# EAGLE schematic OSSIOBC (EAGLE 6.1)

## Sheet 1 of 4
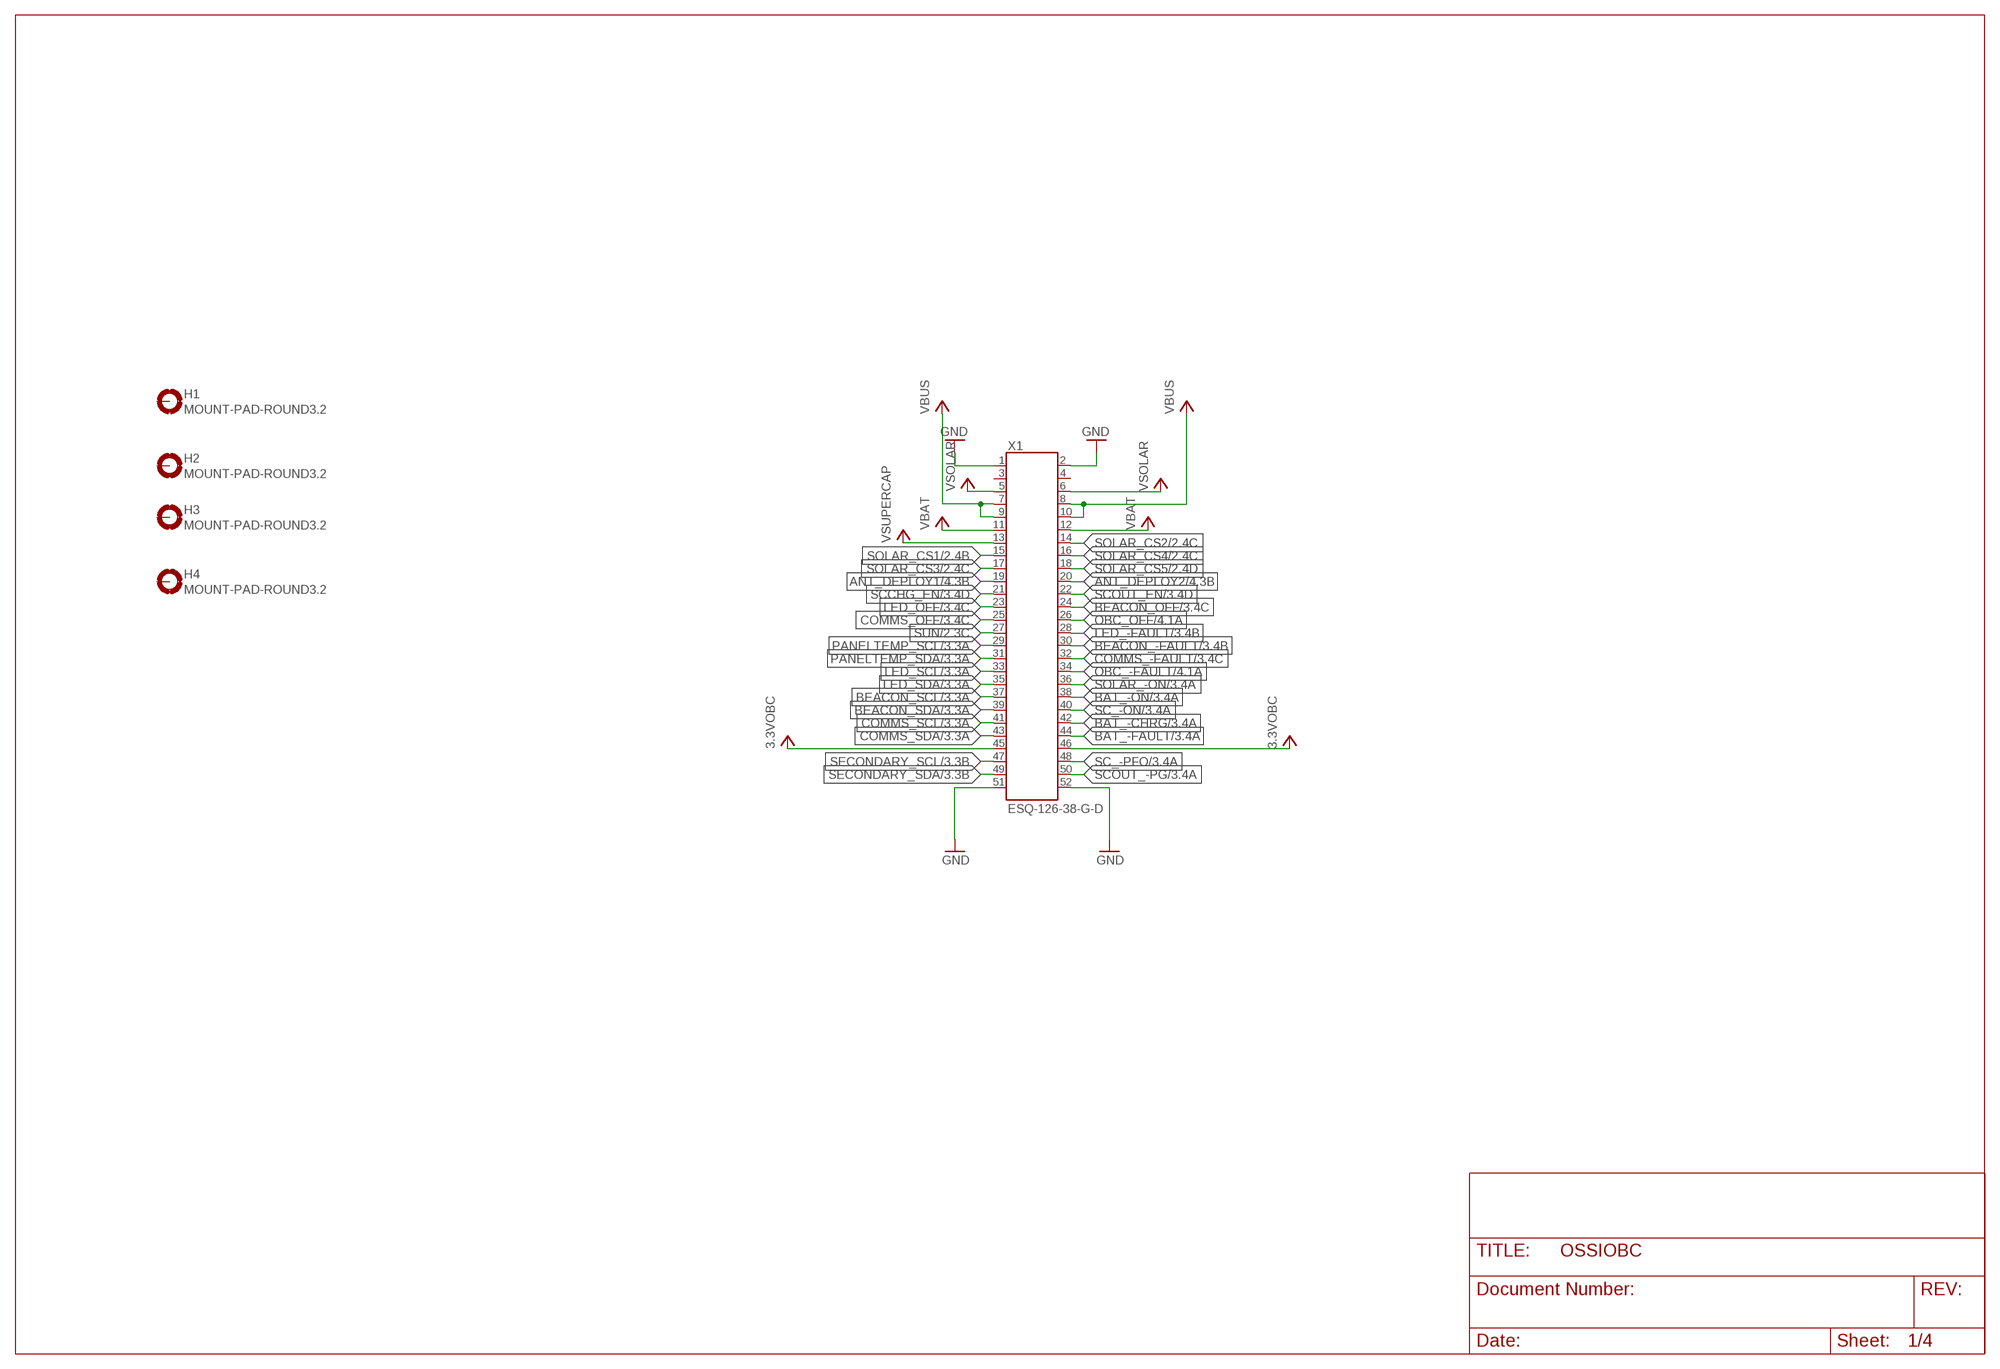
[diagram p0: schematic, sheet 1]

### Parts
H1  MOUNT-PAD-ROUND3.2  [3.2-PAD-ROUND]
H2  MOUNT-PAD-ROUND3.2  [3.2-PAD-ROUND]
H3  MOUNT-PAD-ROUND3.2  [3.2-PAD-ROUND]
H4  MOUNT-PAD-ROUND3.2  [3.2-PAD-ROUND]
X1  ESQ-126-38-G-D  [ESQ-126-XX-X-D]

### Nets
3.3VOBC: X1.45 X1.46 ; also sheet 2,3,4
ANT_DEPLOY1: X1.19 ; also sheet 4
ANT_DEPLOY2: X1.20 ; also sheet 4
BAT_-CHRG: X1.42 ; also sheet 3
BAT_-FAULT: X1.44 ; also sheet 3
BAT_-ON: X1.38 ; also sheet 3
BEACON_-FAULT: X1.30 ; also sheet 3
BEACON_OFF: X1.24 ; also sheet 3
BEACON_SCL: X1.37 ; also sheet 3
BEACON_SDA: X1.39 ; also sheet 3
COMMS_-FAULT: X1.32 ; also sheet 3
COMMS_OFF: X1.25 ; also sheet 3
COMMS_SCL: X1.41 ; also sheet 3
COMMS_SDA: X1.43 ; also sheet 3
GND: X1.1 X1.2 X1.51 X1.52 ; also sheet 2,3,4
LED_-FAULT: X1.28 ; also sheet 3
LED_OFF: X1.23 ; also sheet 3
LED_SCL: X1.33 ; also sheet 3
LED_SDA: X1.35 ; also sheet 3
OBC_-FAULT: X1.34 ; also sheet 4
OBC_OFF: X1.26 ; also sheet 4
PANELTEMP_SCL: X1.29 ; also sheet 3
PANELTEMP_SDA: X1.31 ; also sheet 3
SC_-ON: X1.40 ; also sheet 3
SC_-PFO: X1.48 ; also sheet 3
SCCHG_EN: X1.21 ; also sheet 3
SCOUT_-PG: X1.50 ; also sheet 3
SCOUT_EN: X1.22 ; also sheet 3
SECONDARY_SCL: X1.47 ; also sheet 3
SECONDARY_SDA: X1.49 ; also sheet 3
SOLAR_-ON: X1.36 ; also sheet 3
SOLAR_CS1: X1.15 ; also sheet 2
SOLAR_CS2: X1.14 ; also sheet 2
SOLAR_CS3: X1.17 ; also sheet 2
SOLAR_CS4: X1.16 ; also sheet 2
SOLAR_CS5: X1.18 ; also sheet 2
SUN: X1.27 ; also sheet 2
VBAT: X1.11 X1.12 ; also sheet 2
VBUS: X1.7 X1.8 X1.9 X1.10 ; also sheet 2,3,4
VSOLAR: X1.5 X1.6 ; also sheet 2,3
VSUPERCAP: X1.13 ; also sheet 2
Unconnected: H1.B3,2(MOUNT) H2.B3,2(MOUNT) H3.B3,2(MOUNT) H4.B3,2(MOUNT) X1.3 X1.4

## Sheet 2 of 4
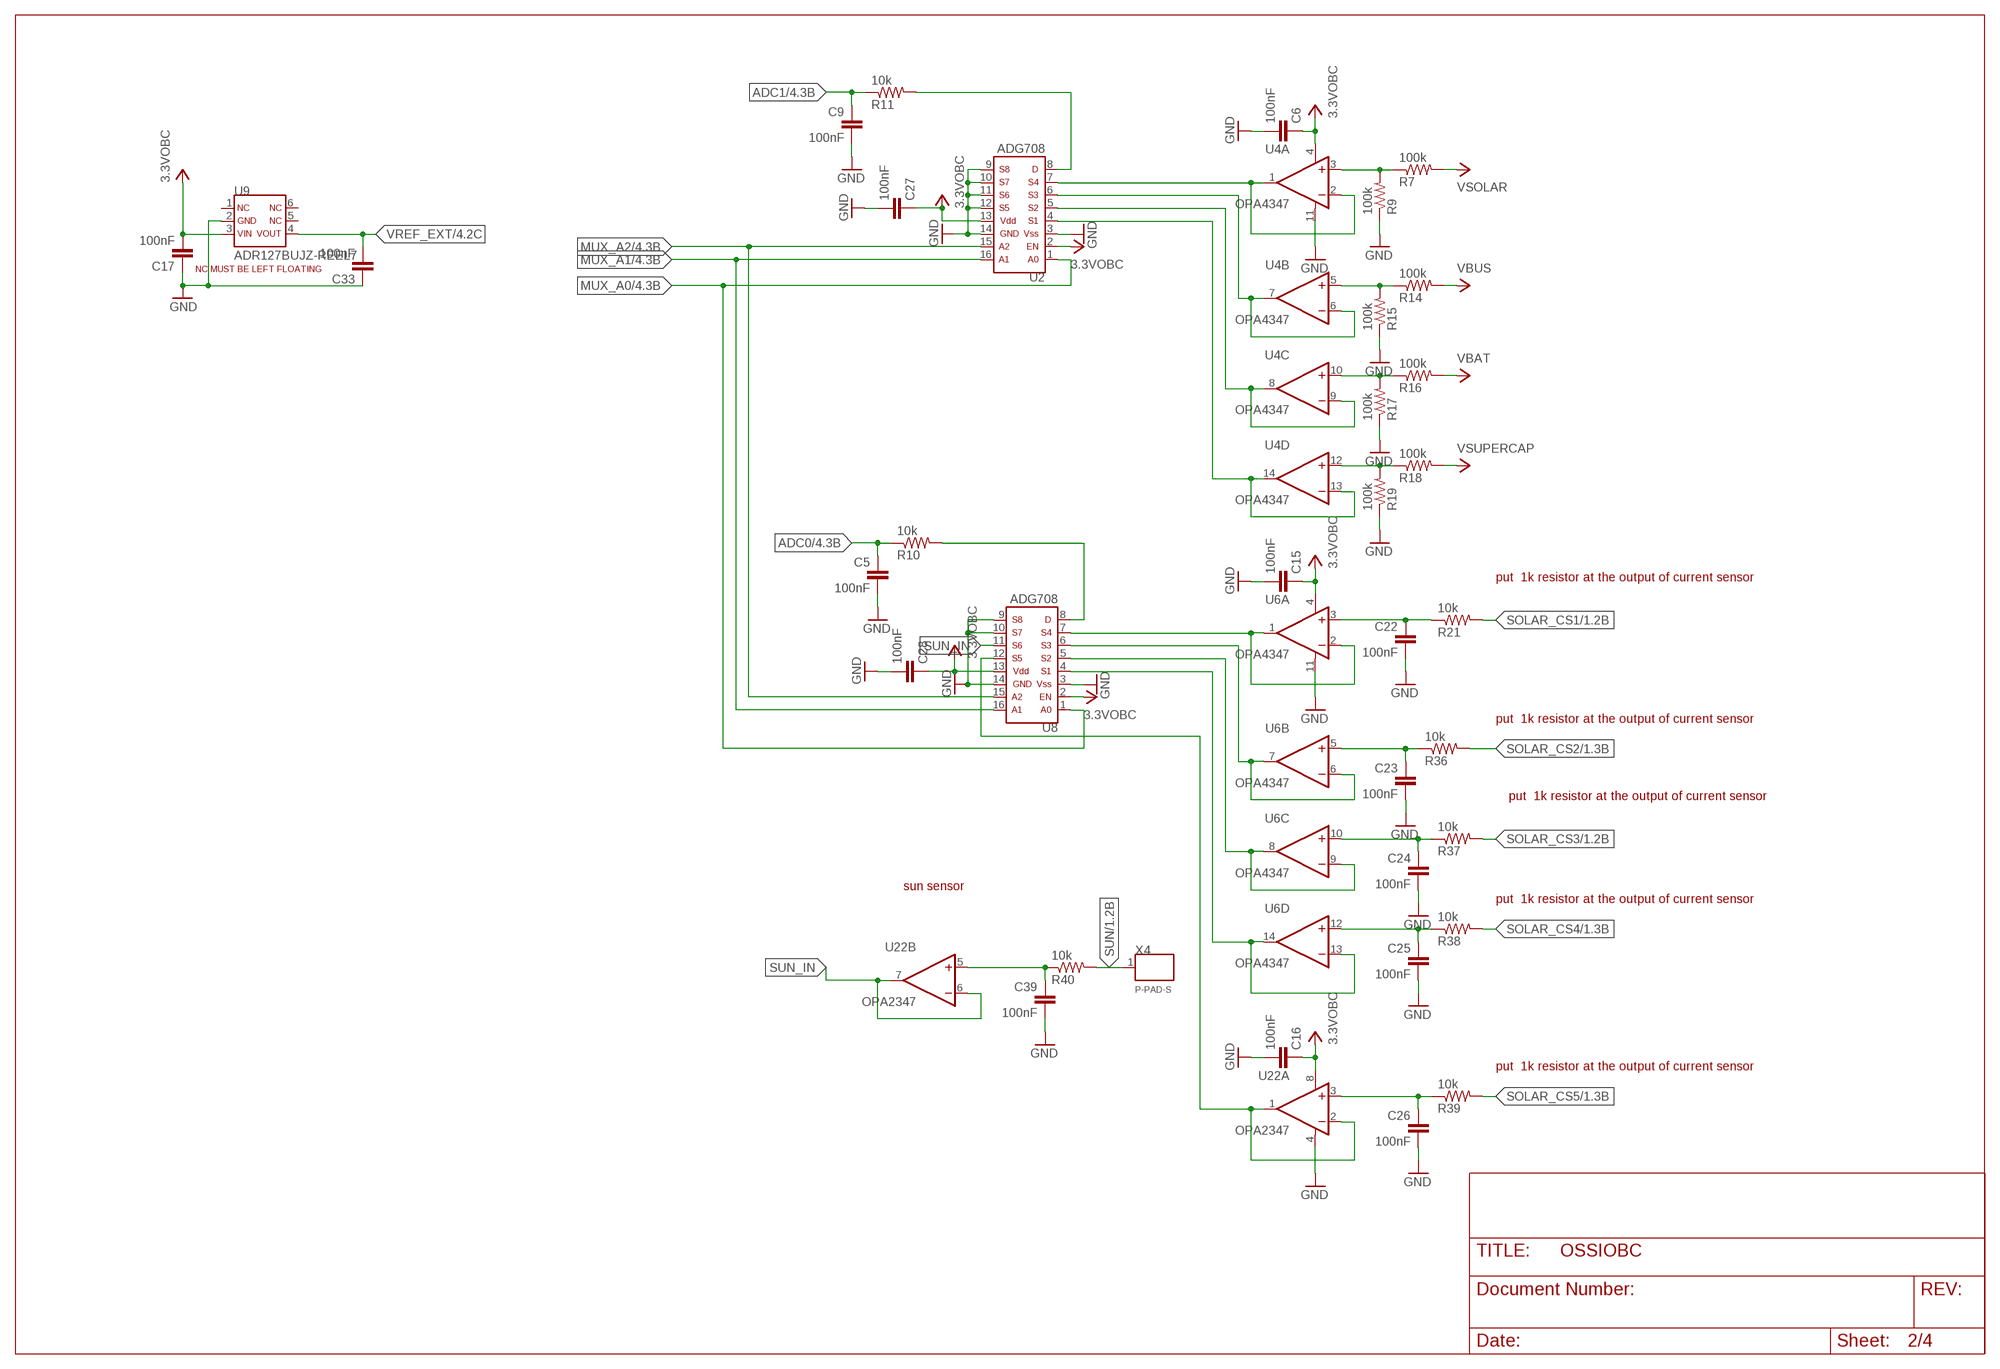
[diagram p1: schematic, sheet 2]

### Parts
C5  100nF  C0603(1608)  [C0603(1608)]
C6  100nF  C0603(1608)  [C0603(1608)]
C9  100nF  C0603(1608)  [C0603(1608)]
C15  100nF  C0603(1608)  [C0603(1608)]
C16  100nF  C0603(1608)  [C0603(1608)]
C17  100nF  C0603(1608)  [C0603(1608)]
C22  100nF  C0603(1608)  [C0603(1608)]
C23  100nF  C0603(1608)  [C0603(1608)]
C24  100nF  C0603(1608)  [C0603(1608)]
C25  100nF  C0603(1608)  [C0603(1608)]
C26  100nF  C0603(1608)  [C0603(1608)]
C27  100nF  C0603(1608)  [C0603(1608)]
C28  100nF  C0603(1608)  [C0603(1608)]
C33  100nF  C0603(1608)  [C0603(1608)]
C39  100nF  C0603(1608)  [C0603(1608)]
R7  100k  R0603(1608)  [R0603(1608)]
R9  100k  R0603(1608)  [R0603(1608)]
R10  10k  R0603(1608)  [R0603(1608)]
R11  10k  R0603(1608)  [R0603(1608)]
R14  100k  R0603(1608)  [R0603(1608)]
R15  100k  R0603(1608)  [R0603(1608)]
R16  100k  R0603(1608)  [R0603(1608)]
R17  100k  R0603(1608)  [R0603(1608)]
R18  100k  R0603(1608)  [R0603(1608)]
R19  100k  R0603(1608)  [R0603(1608)]
R21  10k  R0603(1608)  [R0603(1608)]
R36  10k  R0603(1608)  [R0603(1608)]
R37  10k  R0603(1608)  [R0603(1608)]
R38  10k  R0603(1608)  [R0603(1608)]
R39  10k  R0603(1608)  [R0603(1608)]
R40  10k  R0603(1608)  [R0603(1608)]
U2  ADG708  [TSSOP16-RU]
U4  OPA4347  [TSSOP14-PW]
U6  OPA4347  [TSSOP14-PW]
U8  ADG708  [TSSOP16-RU]
U9  ADR127BUJZ-REEL7  [TSOT-6UJ-6]
U22  OPA2347  [SOT23-8DCN]
X4  P-PAD-S  [P-PAD-S]

### Nets
3.3VOBC: C6.1 C15.1 C16.1 C17.2 C27.1 C28.1 U2.2 U2.13 U4.4(A:V+) U6.4(A:V+) U8.2 U8.13 U9.3 U22.8(A:V+) ; also sheet 1,3,4
ADC0: C5.1 R10.1 ; also sheet 4
ADC1: C9.1 R11.1 ; also sheet 4
GND: C5.2 C6.2 C9.2 C15.2 C16.2 C17.1 C22.2 C23.2 C24.2 C25.2 C26.2 C27.2 C28.2 C33.1 C39.2 R9.1 R15.1 R17.1 R19.1 U2.3 U2.9 U2.10 U2.11 U2.12 U2.14 U4.11(A:V-) U6.11(A:V-) U8.3 U8.9 U8.10 U8.14 U9.2 U22.4(A:V-) ; also sheet 1,3,4
MUX_A0: U2.1 U8.1 ; also sheet 4
MUX_A1: U2.16 U8.16 ; also sheet 4
MUX_A2: U2.15 U8.15 ; also sheet 4
N$2: R7.1 R9.2 U4.3(A:+IN)
N$3: U2.7 U4.1(A:OUT) U4.2(A:-IN)
N$8: U2.6 U4.6(B:-IN) U4.7(B:OUT)
N$9: U2.5 U4.8(C:OUT) U4.9(C:-IN)
N$11: U2.4 U4.13(D:-IN) U4.14(D:OUT)
N$12: U6.1(A:OUT) U6.2(A:-IN) U8.7
N$21: U6.6(B:-IN) U6.7(B:OUT) U8.6
N$24: R14.1 R15.2 U4.5(B:+IN)
N$25: R16.1 R17.2 U4.10(C:+IN)
N$26: R18.1 R19.2 U4.12(D:+IN)
N$27: R11.2 U2.8
N$28: U6.8(C:OUT) U6.9(C:-IN) U8.5
N$29: R10.2 U8.8
N$30: U6.13(D:-IN) U6.14(D:OUT) U8.4
N$31: U8.12 U22.1(A:OUT) U22.2(A:-IN)
N$51: C22.1 R21.1 U6.3(A:+IN)
N$52: C23.1 R36.1 U6.5(B:+IN)
N$53: C24.1 R37.1 U6.10(C:+IN)
N$54: C25.1 R38.1 U6.12(D:+IN)
N$55: C26.1 R39.1 U22.3(A:+IN)
N$58: C39.1 R40.1 U22.5(B:+IN)
SOLAR_CS1: R21.2 ; also sheet 1
SOLAR_CS2: R36.2 ; also sheet 1
SOLAR_CS3: R37.2 ; also sheet 1
SOLAR_CS4: R38.2 ; also sheet 1
SOLAR_CS5: R39.2 ; also sheet 1
SUN: R40.2 X4.1 ; also sheet 1
SUN_IN: U8.11 U22.6(B:-IN) U22.7(B:OUT)
VBAT: R16.2 ; also sheet 1
VBUS: R14.2 ; also sheet 1,3,4
VREF_EXT: C33.2 U9.4 ; also sheet 4
VSOLAR: R7.2 ; also sheet 1,3
VSUPERCAP: R18.2 ; also sheet 1
Unconnected: U9.1 U9.5 U9.6

### Notes on the sheet
- put  1k resistor at the output of current sensor
- put  1k resistor at the output of current sensor
- put  1k resistor at the output of current sensor
- sun sensor
- put  1k resistor at the output of current sensor
- put  1k resistor at the output of current sensor

## Sheet 3 of 4
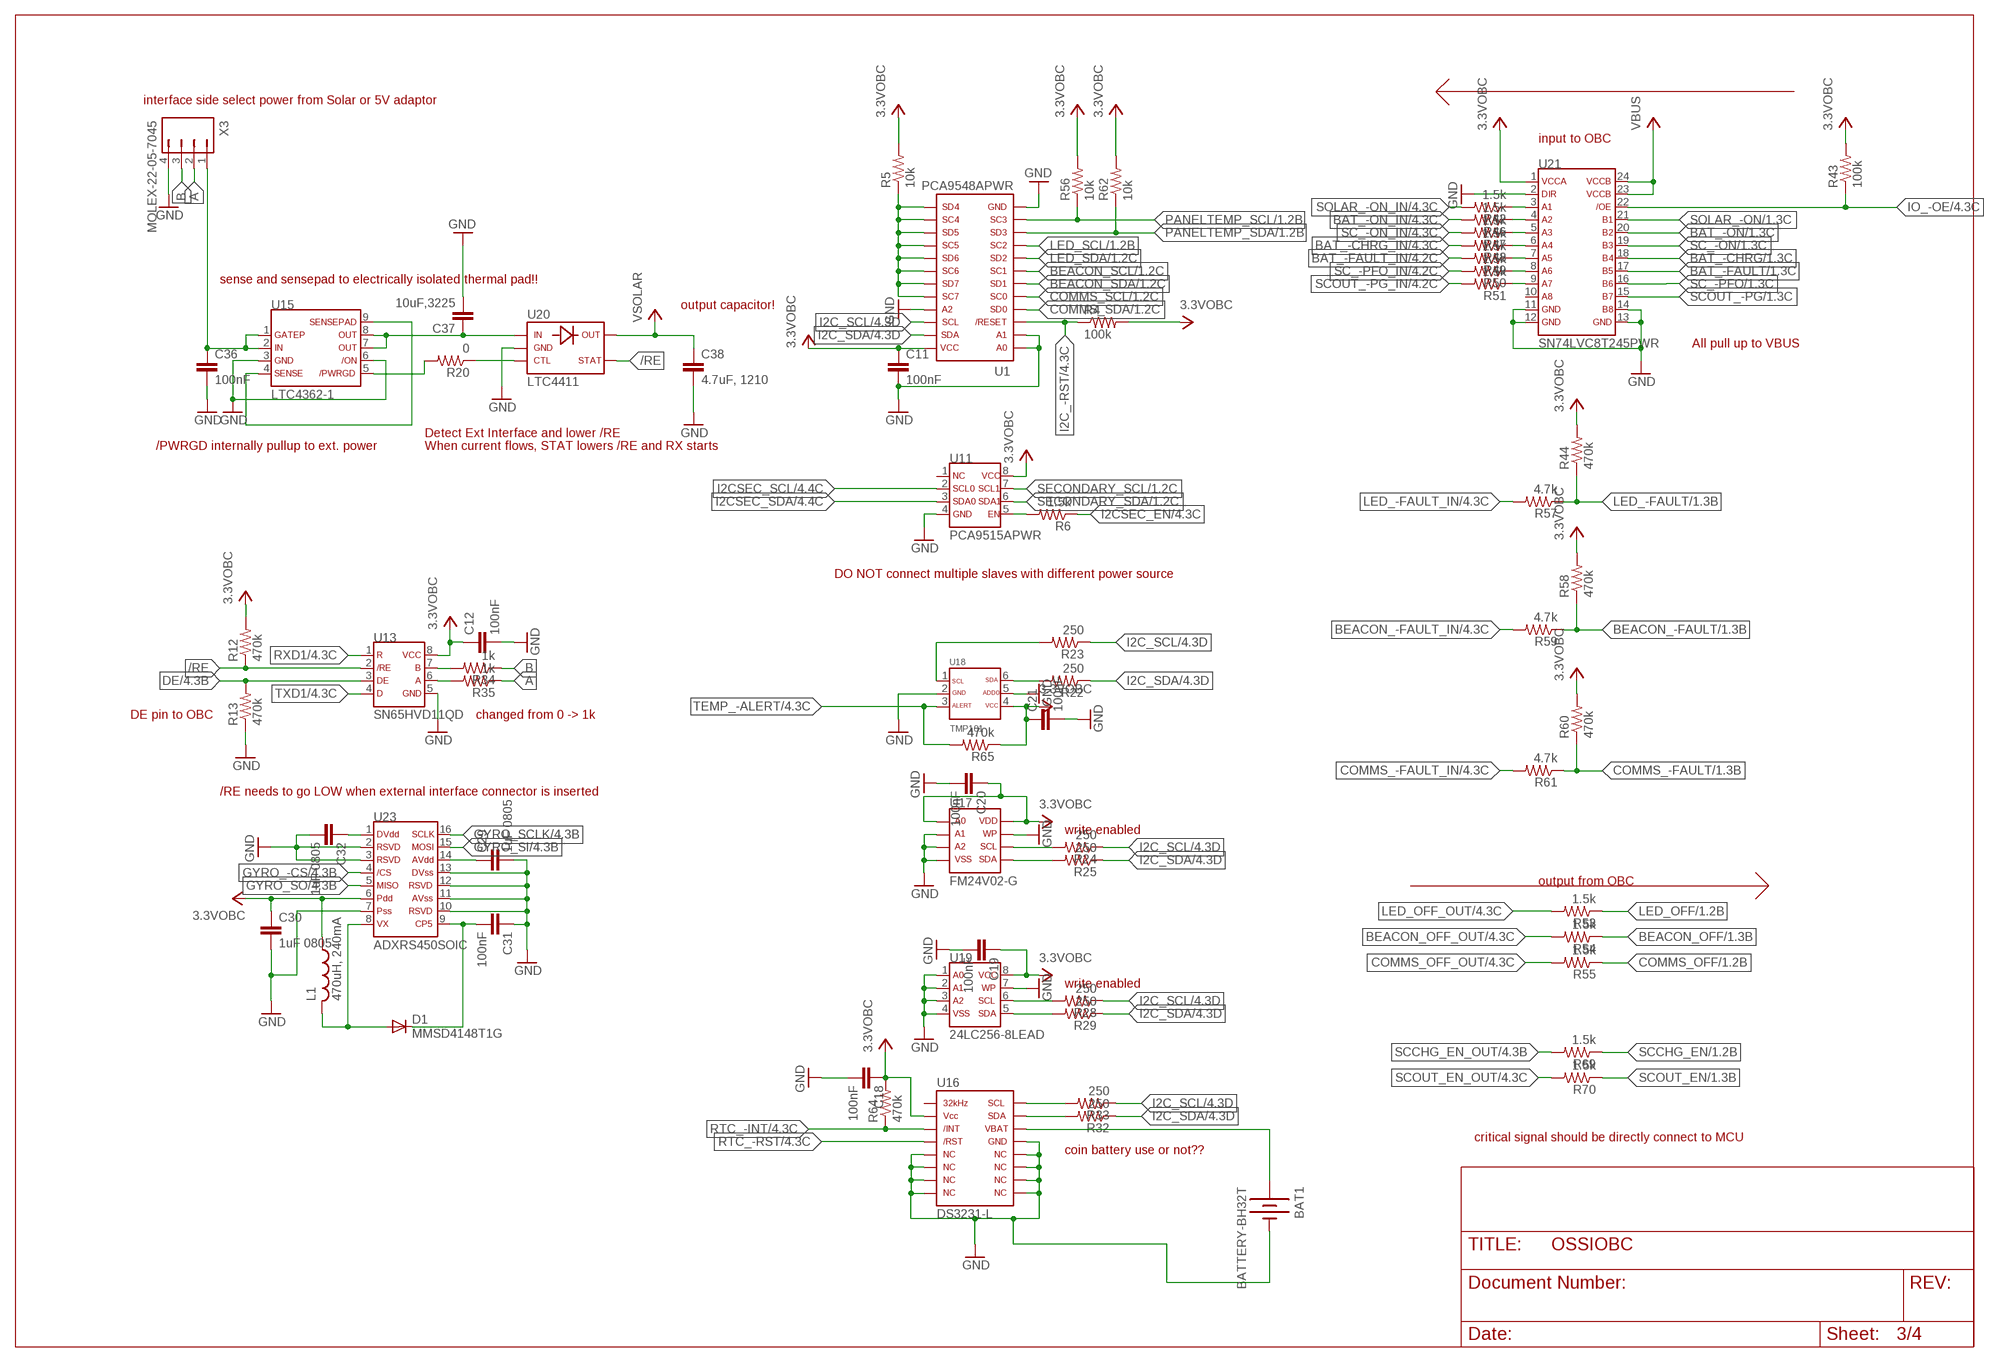
[diagram p2: schematic, sheet 3]

### Parts
BAT1  BATTERY-BH32T  [BH32T-C-G]
C11  100nF  C0603(1608)  [C0603(1608)]
C12  100nF  C0603(1608)  [C0603(1608)]
C18  100nF  C0603(1608)  [C0603(1608)]
C19  100nF  C0603(1608)  [C0603(1608)]
C20  100nF  C0603(1608)  [C0603(1608)]
C21  100nF  C0603(1608)  [C0603(1608)]
C29  1uF 0805  C0805(2012)  [C0805(2012)]
C30  1uF 0805  C0805(2012)  [C0805(2012)]
C31  100nF  C0603(1608)  [C0603(1608)]
C32  1uF 0805  C0805(2012)  [C0805(2012)]
C36  100nF  C0603(1608)  [C0603(1608)]
C37  10uF,3225  C1210(3225)-GCM32  [C1210-GCM32]
C38  4.7uF, 1210  C1206(3216)-GCM31  [C1206-GCM31]
D1  MMSD4148T1G  [SOD-123]
L1  470uH, 240mA  LQH55  [L(2220)]
R4  100k  R0603(1608)  [R0603(1608)]
R5  10k  R0603(1608)  [R0603(1608)]
R6  1.5k  R0603(1608)  [R0603(1608)]
R12  470k  R0603(1608)  [R0603(1608)]
R13  470k  R0603(1608)  [R0603(1608)]
R20  0  R0603(1608)  [R0603(1608)]
R22  250  R0603(1608)  [R0603(1608)]
R23  250  R0603(1608)  [R0603(1608)]
R24  250  R0603(1608)  [R0603(1608)]
R25  250  R0603(1608)  [R0603(1608)]
R28  250  R0603(1608)  [R0603(1608)]
R29  250  R0603(1608)  [R0603(1608)]
R32  250  R0603(1608)  [R0603(1608)]
R33  250  R0603(1608)  [R0603(1608)]
R34  1k  R0603(1608)  [R0603(1608)]
R35  1k  R0603(1608)  [R0603(1608)]
R42  1.5k  R0603(1608)  [R0603(1608)]
R43  100k  R0603(1608)  [R0603(1608)]
R44  470k  R0603(1608)  [R0603(1608)]
R46  1.5k  R0603(1608)  [R0603(1608)]
R47  1.5k  R0603(1608)  [R0603(1608)]
R48  1.5k  R0603(1608)  [R0603(1608)]
R49  1.5k  R0603(1608)  [R0603(1608)]
R50  1.5k  R0603(1608)  [R0603(1608)]
R51  1.5k  R0603(1608)  [R0603(1608)]
R53  1.5k  R0603(1608)  [R0603(1608)]
R54  1.5k  R0603(1608)  [R0603(1608)]
R55  1.5k  R0603(1608)  [R0603(1608)]
R56  10k  R0603(1608)  [R0603(1608)]
R57  4.7k  R0603(1608)  [R0603(1608)]
R58  470k  R0603(1608)  [R0603(1608)]
R59  4.7k  R0603(1608)  [R0603(1608)]
R60  470k  R0603(1608)  [R0603(1608)]
R61  4.7k  R0603(1608)  [R0603(1608)]
R62  10k  R0603(1608)  [R0603(1608)]
R64  470k  R0603(1608)  [R0603(1608)]
R65  470k  R0603(1608)  [R0603(1608)]
R69  1.5k  R0603(1608)  [R0603(1608)]
R70  1.5k  R0603(1608)  [R0603(1608)]
U1  PCA9548APWR  [TSSOP-24-PW]
U11  PCA9515APWR  [TSSOP-8]
U13  SN65HVD11QD  [SO8]
U15  LTC4362-1  [DFN8-2X3]
U16  DS3231-L  [SO16L]
U17  FM24V02-G  [SO8]
U18  TMP101  [SOT23-6DBV]
U19  24LC256-8LEAD  [SO08-208]
U20  LTC4411  [TSOT23-5]
U21  SN74LVC8T245PWR  [PW_R-PDSO-G24]
U23  ADXRS450SOIC  [SOIC-16CAV]
X3  MOLEX-22-05-7045  [22-05-7045]

### Nets
3.3VOBC: C11.1 C12.1 C18.1 C19.1 C20.1 C21.1 C30.1 L1.P$1 R4.2 R5.2 R12.2 R43.2 R44.2 R56.2 R58.2 R60.2 R62.2 R64.2 R65.1 U1.24 U11.8 U13.8 U16.2 U17.1(A0) U17.8(VDD) U18.4 U19.8 U21.1 U23.6 ; also sheet 1,2,4
/RE: R12.1 U13.2 U20.P$4
A: R35.1 X3.2
B: R34.1 X3.3
BAT_-CHRG: U21.18 ; also sheet 1
BAT_-CHRG_IN: R48.2 ; also sheet 4
BAT_-FAULT: U21.17 ; also sheet 1
BAT_-FAULT_IN: R49.2 ; also sheet 4
BAT_-ON: U21.20 ; also sheet 1
BAT_-ON_IN: R46.2 ; also sheet 4
BEACON_-FAULT: R58.1 R59.1 ; also sheet 1
BEACON_-FAULT_IN: R59.2 ; also sheet 4
BEACON_OFF: R54.1 ; also sheet 1
BEACON_OFF_OUT: R54.2 ; also sheet 4
BEACON_SCL: U1.7 ; also sheet 1
BEACON_SDA: U1.6 ; also sheet 1
COMMS_-FAULT: R60.1 R61.1 ; also sheet 1
COMMS_-FAULT_IN: R61.2 ; also sheet 4
COMMS_OFF: R55.1 ; also sheet 1
COMMS_OFF_OUT: R55.2 ; also sheet 4
COMMS_SCL: U1.5 ; also sheet 1
COMMS_SDA: U1.4 ; also sheet 1
DE: R13.2 U13.3 ; also sheet 4
GND: BAT1.N(-) C11.2 C12.2 C18.2 C19.2 C20.2 C21.2 C29.2 C30.2 C31.1 C32.2 C36.2 C37.P$2 C38.P$2 R13.1 U1.1 U1.2 U1.12 U1.21 U11.4 U13.5 U15.3 U15.6 U16.5 U16.6 U16.7 U16.8 U16.9 U16.10 U16.11 U16.12 U16.13 U17.2(A1) U17.3(A2) U17.4(VSS) U17.7(WP) U18.2 U18.5 U19.1 U19.2 U19.3 U19.4 U19.7 U20.P$2 U21.2 U21.11 U21.12 U21.13 U21.14 U23.2 U23.3 U23.7 U23.10 U23.11 U23.12 U23.13 X3.4 ; also sheet 1,2,4
GYRO_-CS: U23.4 ; also sheet 4
GYRO_SCLK: U23.16 ; also sheet 4
GYRO_SI: U23.15 ; also sheet 4
GYRO_SO: U23.5 ; also sheet 4
I2C_-RST: R4.1 U1.3 ; also sheet 4
I2C_SCL: R23.1 R24.1 R28.1 R33.1 U1.22 ; also sheet 4
I2C_SDA: R22.1 R25.1 R29.1 R32.1 U1.23 ; also sheet 4
I2CSEC_EN: R6.1 ; also sheet 4
I2CSEC_SCL: U11.2 ; also sheet 4
I2CSEC_SDA: U11.3 ; also sheet 4
IO_-OE: R43.1 U21.22 ; also sheet 4
LED_-FAULT: R44.1 R57.1 ; also sheet 1
LED_-FAULT_IN: R57.2 ; also sheet 4
LED_OFF: R53.1 ; also sheet 1
LED_OFF_OUT: R53.2 ; also sheet 4
LED_SCL: U1.9 ; also sheet 1
LED_SDA: U1.8 ; also sheet 1
N$4: C36.1 U15.1 U15.2 X3.1
N$7: R32.2 U16.15
N$14: R34.2 U13.7
N$15: R33.2 U16.16
N$16: R5.1 U1.13 U1.14 U1.15 U1.16 U1.17 U1.18 U1.19 U1.20
N$22: R35.2 U13.6
N$33: C32.1 U23.1
N$34: R29.2 U19.5
N$35: R28.2 U19.6
N$36: R25.2 U17.5(SDA)
N$39: R24.2 U17.6(SCL)
N$40: R22.2 U18.6
N$41: R23.2 U18.1
N$42: C37.P$1 U15.7 U15.8 U20.P$1
N$43: U15.4 U15.9
N$44: R6.2 U11.5
N$45: R20.2 U15.5
N$46: C29.1 U23.14
N$47: R20.1 U20.P$3
N$49: R48.1 U21.6
N$50: R49.1 U21.7
N$56: R50.1 U21.8
N$57: R51.1 U21.9
N$65: BAT1.P(+) U16.14
N$70: R47.1 U21.5
N$71: R46.1 U21.4
N$72: R42.1 U21.3
N$82: D1.A L1.P$2 U23.8
N$90: C31.2 D1.C U23.9
PANELTEMP_SCL: R56.1 U1.11 ; also sheet 1
PANELTEMP_SDA: R62.1 U1.10 ; also sheet 1
RTC_-INT: R64.1 U16.3 ; also sheet 4
RTC_-RST: U16.4 ; also sheet 4
RXD1: U13.1 ; also sheet 4
SC_-ON: U21.19 ; also sheet 1
SC_-ON_IN: R47.2 ; also sheet 4
SC_-PFO: U21.16 ; also sheet 1
SC_-PFO_IN: R50.2 ; also sheet 4
SCCHG_EN: R69.1 ; also sheet 1
SCCHG_EN_OUT: R69.2 ; also sheet 4
SCOUT_-PG: U21.15 ; also sheet 1
SCOUT_-PG_IN: R51.2 ; also sheet 4
SCOUT_EN: R70.1 ; also sheet 1
SCOUT_EN_OUT: R70.2 ; also sheet 4
SECONDARY_SCL: U11.7 ; also sheet 1
SECONDARY_SDA: U11.6 ; also sheet 1
SOLAR_-ON: U21.21 ; also sheet 1
SOLAR_-ON_IN: R42.2 ; also sheet 4
TEMP_-ALERT: R65.2 U18.3 ; also sheet 4
TXD1: U13.4 ; also sheet 4
VBUS: U21.23 U21.24 ; also sheet 1,2,4
VSOLAR: C38.P$1 U20.P$5 ; also sheet 1,2
Unconnected: U11.1 U16.1 U21.10

### Notes on the sheet
- interface side select power from Solar or 5V adaptor
- input to OBC
- sense and sensepad to electrically isolated thermal pad!!
- output capacitor!
- All pull up to VBUS
- Detect Ext Interface and lower /RE
- /PWRGD internally pullup to ext. power | When current flows, STAT lowers /RE and RX starts
- DO NOT connect multiple slaves with different power source
- DE pin to OBC | changed from 0 -> 1k
- /RE needs to go LOW when external interface connector is inserted
- write enabled
- output from OBC
- write enabled
- critical signal should be directly connect to MCU
- coin battery use or not??

## Sheet 4 of 4
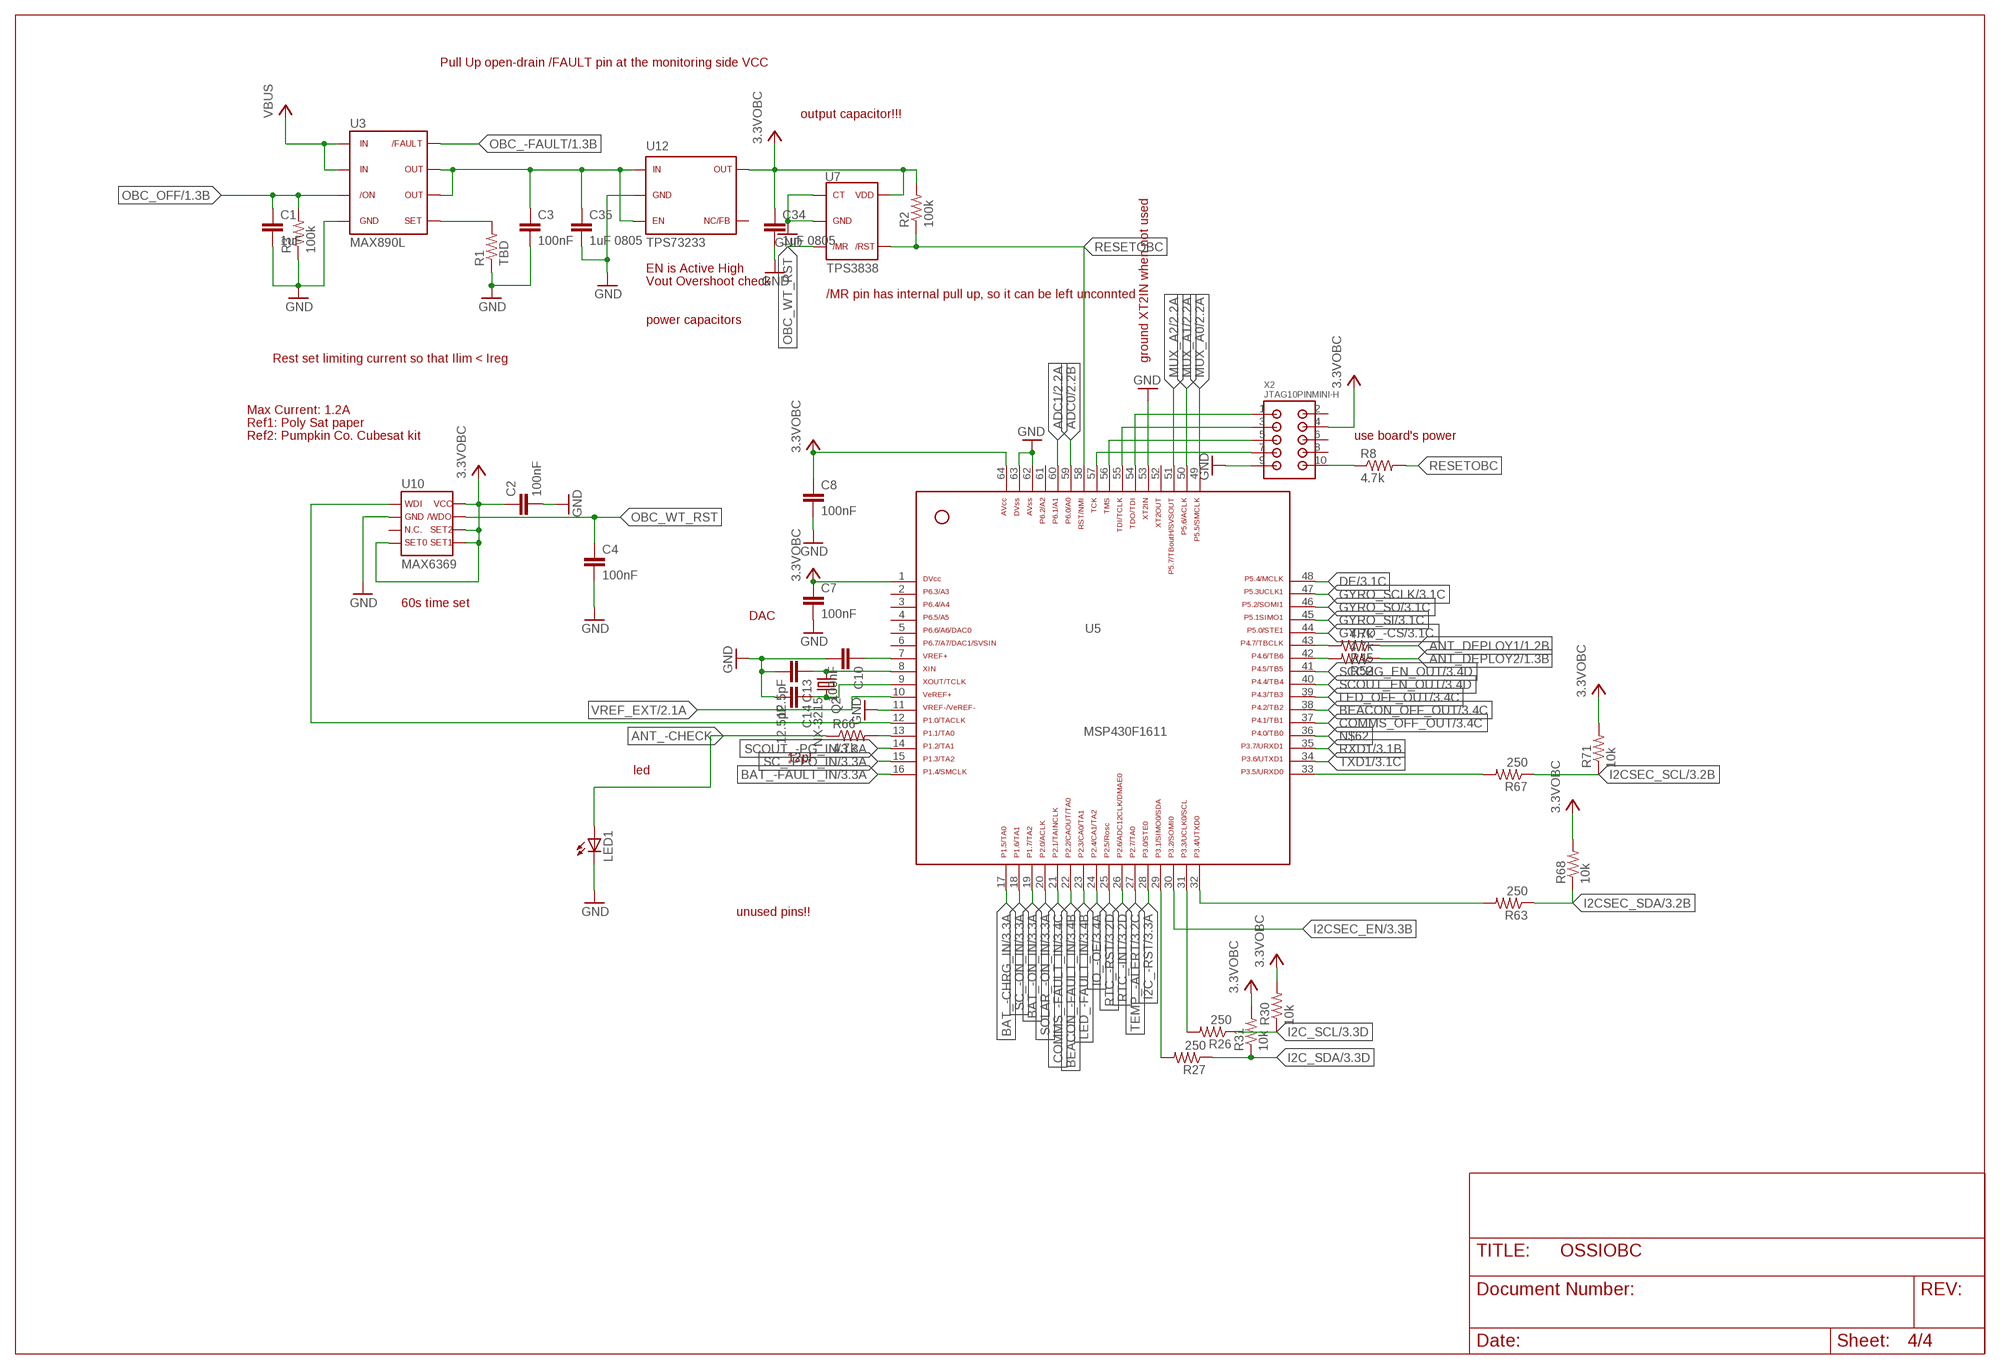
[diagram p3: schematic, sheet 4]

### Parts
C1  1uF  C0603(1608)  [C0603(1608)]
C2  100nF  C0603(1608)  [C0603(1608)]
C3  100nF  C0603(1608)  [C0603(1608)]
C4  100nF  C0603(1608)  [C0603(1608)]
C7  100nF  C0603(1608)  [C0603(1608)]
C8  100nF  C0603(1608)  [C0603(1608)]
C10  100nF  C0603(1608)  [C0603(1608)]
C13  12.5pF  C0603(1608)  [C0603(1608)]
C14  12.5pF  C0603(1608)  [C0603(1608)]
C34  1uF 0805  C0805(2012)  [C0805(2012)]
C35  1uF 0805  C0805(2012)  [C0805(2012)]
LED1  LED0603  [LED-0603]
Q2  NX-3215  [NX-3215]
R1  TBD  R0603(1608)  [R0603(1608)]
R2  100k  R0603(1608)  [R0603(1608)]
R3  100k  R0603(1608)  [R0603(1608)]
R8  4.7k  R0603(1608)  [R0603(1608)]
R26  250  R0603(1608)  [R0603(1608)]
R27  250  R0603(1608)  [R0603(1608)]
R30  10k  R0603(1608)  [R0603(1608)]
R31  10k  R0603(1608)  [R0603(1608)]
R45  4.7k  R0603(1608)  [R0603(1608)]
R52  4.7k  R0603(1608)  [R0603(1608)]
R63  250  R0603(1608)  [R0603(1608)]
R66  4.7k  R0603(1608)  [R0603(1608)]
R67  250  R0603(1608)  [R0603(1608)]
R68  10k  R0603(1608)  [R0603(1608)]
R71  10k  R0603(1608)  [R0603(1608)]
U3  MAX890L  [SO8]
U5  MSP430F1611  [PM/PAG64]
U7  TPS3838  [SOT23-5DBV]
U10  MAX6369  [SOT23-8]
U12  TPS73233  [SOT23-5DBV]
X2  JTAG10PINMINI-H  [M50-3200545]

### Nets
3.3VOBC: C2.1 C7.1 C8.1 C34.1 R2.2 R30.2 R31.2 R68.2 R71.2 U5.1 U5.64 U7.5 U10.4 U10.5 U10.6 U10.8 U12.5 X2.4 ; also sheet 1,2,3
ADC0: U5.59 ; also sheet 2
ADC1: U5.60 ; also sheet 2
ANT_-CHECK: LED1.A R66.1
ANT_DEPLOY1: R45.1 ; also sheet 1
ANT_DEPLOY2: R52.1 ; also sheet 1
BAT_-CHRG_IN: U5.17 ; also sheet 3
BAT_-FAULT_IN: U5.16 ; also sheet 3
BAT_-ON_IN: U5.19 ; also sheet 3
BEACON_-FAULT_IN: U5.22 ; also sheet 3
BEACON_OFF_OUT: U5.38 ; also sheet 3
COMMS_-FAULT_IN: U5.21 ; also sheet 3
COMMS_OFF_OUT: U5.37 ; also sheet 3
DE: U5.48 ; also sheet 3
GND: C1.2 C2.2 C3.2 C4.2 C7.2 C8.2 C10.2 C13.2 C14.2 C34.2 C35.2 LED1.C R1.1 R3.1 U3.4 U5.11 U5.53 U5.62 U5.63 U7.1 U7.2 U10.2 U12.2 X2.9 ; also sheet 1,2,3
GYRO_-CS: U5.44 ; also sheet 3
GYRO_SCLK: U5.47 ; also sheet 3
GYRO_SI: U5.45 ; also sheet 3
GYRO_SO: U5.46 ; also sheet 3
I2C_-RST: U5.28 ; also sheet 3
I2C_SCL: R26.1 R30.1 ; also sheet 3
I2C_SDA: R27.1 R31.1 ; also sheet 3
I2CSEC_EN: U5.30 ; also sheet 3
I2CSEC_SCL: R67.1 R71.1 ; also sheet 3
I2CSEC_SDA: R63.1 R68.1 ; also sheet 3
IO_-OE: U5.24 ; also sheet 3
LED_-FAULT_IN: U5.23 ; also sheet 3
LED_OFF_OUT: U5.39 ; also sheet 3
MUX_A0: U5.49 ; also sheet 2
MUX_A1: U5.50 ; also sheet 2
MUX_A2: U5.51 ; also sheet 2
N$1: U5.12 U10.1
N$5: C13.1 Q2.1 U5.8
N$6: C14.1 Q2.2 U5.9
N$10: R1.2 U3.5
N$13: C10.1 U5.7
N$17: U5.57 X2.7
N$18: U5.56 X2.5
N$19: U5.55 X2.3
N$20: U5.54 X2.1
N$23: R8.1 X2.10
N$32: R66.2 U5.13
N$37: R45.2 U5.43
N$38: R52.2 U5.42
N$59: R67.2 U5.33
N$60: R27.2 U5.29
N$61: R26.2 U5.31
N$62: U5.36
N$64: R63.2 U5.32
N$666: C3.1 C35.1 U3.6 U3.7 U12.1 U12.3
OBC_-FAULT: U3.8 ; also sheet 1
OBC_OFF: C1.1 R3.2 U3.3 ; also sheet 1
OBC_WT_RST: C4.1 U7.3 U10.7
RESETOBC: R2.1 R8.2 U5.58 U7.4
RTC_-INT: U5.26 ; also sheet 3
RTC_-RST: U5.25 ; also sheet 3
RXD1: U5.35 ; also sheet 3
SC_-ON_IN: U5.18 ; also sheet 3
SC_-PFO_IN: U5.15 ; also sheet 3
SCCHG_EN_OUT: U5.41 ; also sheet 3
SCOUT_-PG_IN: U5.14 ; also sheet 3
SCOUT_EN_OUT: U5.40 ; also sheet 3
SOLAR_-ON_IN: U5.20 ; also sheet 3
TEMP_-ALERT: U5.27 ; also sheet 3
TXD1: U5.34 ; also sheet 3
VBUS: U3.1 U3.2 ; also sheet 1,2,3
VREF_EXT: U5.10 ; also sheet 2
Unconnected: U5.2 U5.3 U5.4 U5.5 U5.6 U5.52 U5.61 U10.3 U12.4 X2.2 X2.6 X2.8

### Notes on the sheet
- Pull Up open-drain /FAULT pin at the monitoring side VCC
- output capacitor!!!
- EN is Active High
- Vout Overshoot check
- /MR pin has internal pull up, so it can be left unconnted
- power capacitors
- Rest set limiting current so that Ilim < Ireg | ground XT2IN when not used
- Max Current: 1.2A
- Ref1: Poly Sat paper
- Ref2: Pumpkin Co. Cubesat kit | use board's power
- 60s time set
- DAC
- 12pF
- led
- unused pins!!

## Library data of the parts
BAT1 = OSSI:BATTERY
C1-C39 = OSSI:C
D1 = OSSI:MMSD4148T1G
H1-H4 = OSSI:MOUNT-PAD-ROUND
L1 = OSSI:L
LED1 = SparkFun:LED: LEDs Standard schematic elements and footprints for 5mm, 3mm, 1206, and 0603 sized LEDs. 5mm - Spark Fun Electronics SKU : COM-00529 (and others)
Q2 = OSSI:NX-3215: NDK 32.768 kHz SMD Crystal P/N: NX3215SA-32.768K-STD-MUA-9 Nominal frequency (kHz): 32.768 Package Size (L×W×H : mm): 3.2×1.5×0.8 Operating Temperature Range(*1) / Storage Temperature Range (°C): -40 to +85 / -40 to +85 Level of drive: 0.1µW (Max. 0.5µW) Frequency Tolerance (25±3°C): ±20×10-6 Load Capacitance: 9.0pF, 12.5pF Equivalent Series Resistance: 70kΩ Max. Ordering Code: NX3215SA-32.768K-STD-MUA-9 (Load Capacitance9.0pF) /NX3215SA-32.768K-STD-MUA-8 (Load Capacitance12.5pF)
R1-R40 R42-R71 = OSSI:R
U1 = OSSI:PCA9548APWR: PCA9548APWR 8-Channel I2C Switch With Reset 1-of-8 Bidirectional Translating Switches Address by Three Hardware Address Pins for Use of up to Eight Devices Operating Power: 2.3 V to 5.5 V Active-Low Reset Input
U2 U8 = OSSI:ADG70*
U3 = OSSI:MAX890L: MAX 890L 1.2A, Current-Limited, High-Side P-Channel Switch with Thermal Shutdown BY MAXIM
U4 U6 = OSSI:OPA4347: OPA4347 RAIL-TO-RAIL INPUT AND OUTPUT SINGLE SUPPLY: 2.3V to 5.5V LOW IQ: 20µ
U5 = OSSI:MSP430F1611: MSP430F1611
U7 = OSSI:TPS3838: TPS3838 NanoPower Supervisory IC from texas instruments. TPS3838 is open-drain output
U9 = OSSI:ADR127: ADR127 Precision, Micropower LDO Voltage References in TSOT ADR127BUJZ-REEL7
U10 = OSSI:MAX6369: MAX6369 Pin-Selectable Watchdog Timers Max 6369 is Open-drain output 1 ms to 60 s seletable timeout
U11 = OSSI:PCA9515A: PCA9515A DUAL BIDIRECTIONAL I2C BUS AND SMBus REPEATER by Texas Instrument Iq = 500uA
U12 = OSSI:TPS732*: TPS732XX LDO 250mA / 40mV drop out EN pin is Active High!!
U13 = OSSI:SN65HVD11: SN65HVD11 3.3V RS485 Transceiver QD: -40~+125
U15 = OSSI:LTC4362: LTC4362-1/LTC4362-2 1.2A Overvoltage/ Overcurrent Protector
U16 = OSSI:DS3231: DS3231 Extremely Accureate I2C integrated RTC/TCXO/Crystal by MAXIM
U17 = OSSI:FM24V02: FM24V02 256Kb Serial 3V F-RAM Memory by RAMTRON
U18 = OSSI:TMP101: TMP101 Digital Temerature Sensor with I2C Interface from Texas Instruments with Alert Function
U19 = OSSI:24LC256: 24LC256 256K I2C™ CMOS Serial EEPROM
U20 = OSSI:LTC4411: Linear Techonology LTC4411 ideal diode Small Regulated Forward Voltage (28mV) 2.6A Maximum Forward Current 2.6V to 5.5V Operating Range MOSFET based
U21 = OSSI:SN74LVC8T245: SN74LVC8T245 8-BIT DUAL-SUPPLY BUS TRANSCEIVER WITH CONFIGURABLE VOLTAGE TRANSLATION AND 3-STATE OUTPUTS
U22 = OSSI:OPA2347: OPA2347 RAIL-TO-RAIL INPUT AND OUTPUT SINGLE SUPPLY: 2.3V to 5.5V LOW IQ: 20µ
U23 = OSSI:ADXRS450SOIC
X1 = OSSI:ESQ-126-: Samtec ESQ-126-XX-G-D Elevated Sockets Seires ESQ-126-37-G-D ESQ-126-38-G-D ESQ-126-39-G-D
X2 = OSSI:JTAG10PINMINI
X3 = OSSI:MOLEX-22-05-7045: molex spoxt 5268 series 22-05-7045 for external interface
X4 = OSSI:P-PAD